# Altium schematic sheet Filtering.SchDoc: Myon Deco - Filtering Stages
size A; DrawnBy: Matias Lopez; Revision: Prototype; SheetNumber: 5; SheetTotal: 6
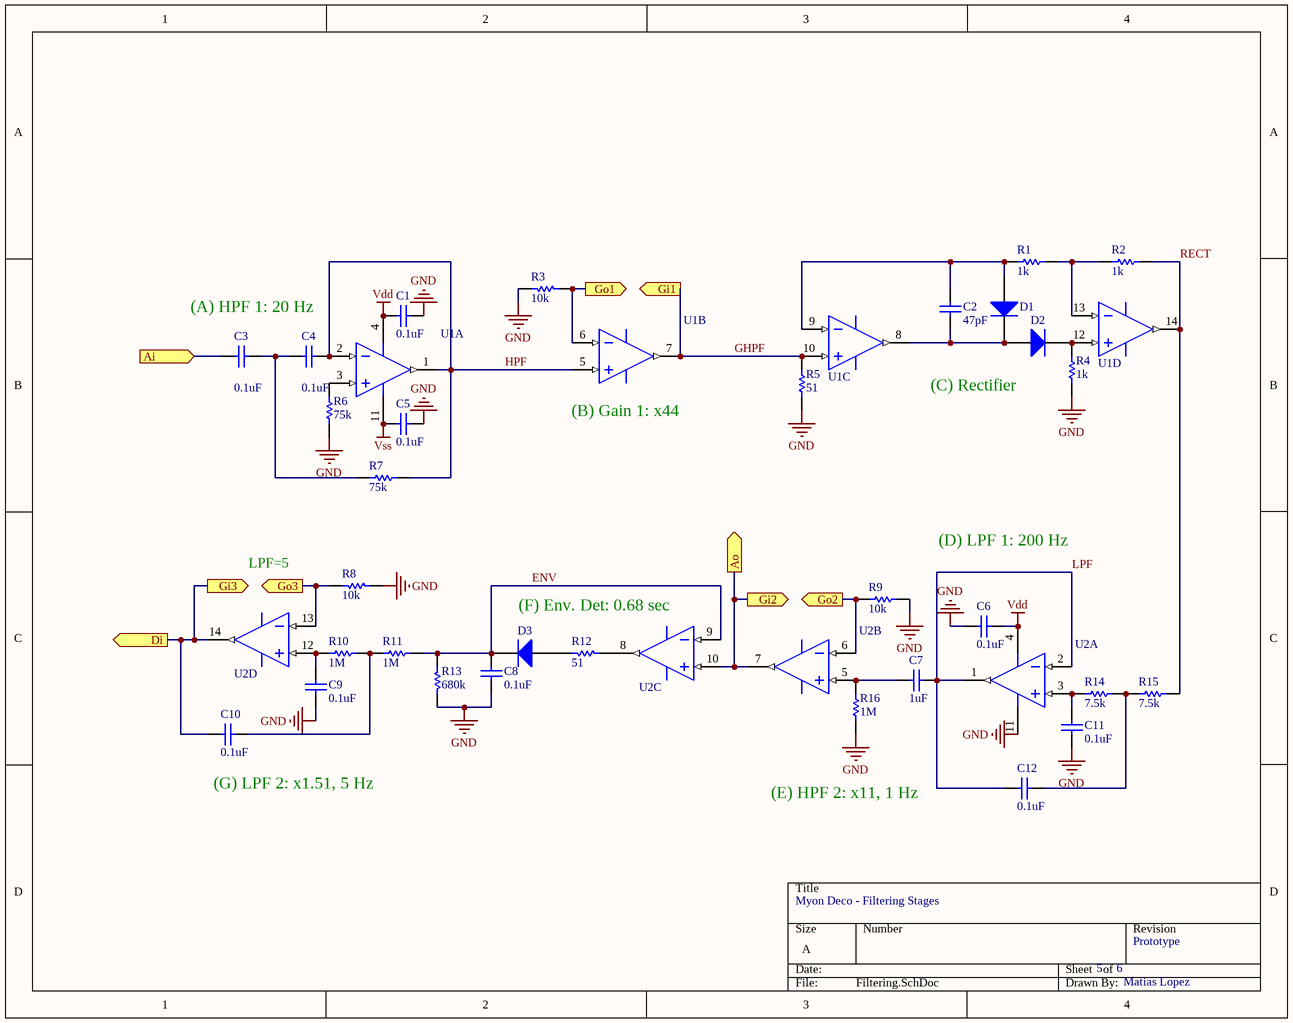
[diagram p0: Filtering.SchDoc]

## Parts
C1  value 0.1uF  [C0805]  (hidden comment: Cap)
C2  value 47pF  [C0805]  (hidden comment: C20)
C3  value 0.1uF  [C0805]  (hidden comment: C15)
C4  value 0.1uF  [C0805]  (hidden comment: C16)
C5  value 0.1uF  [C0805]  (hidden comment: Cap)
C6  value 0.1uF  [C0805]  (hidden comment: Cap)
C7  value 1uF  [C0805]  (hidden comment: C19)
C8  value 0.1uF  [C0805]  (hidden comment: C23)
C9  value 0.1uF  [C0805]  (hidden comment: C21)
C10  value 0.1uF  [C0805]  (hidden comment: C22)
C11  value 0.1uF  [C0805]  (hidden comment: C21)
C12  value 0.1uF  [C0805]  (hidden comment: C22)
D1  D2  [425]  (value not drawn)
D2  D3  [425]  (value not drawn)
D3  D4  [425]  (value not drawn)
R1  value 1k  [C1206]  (hidden comment: R20)
R2  value 1k  [C1206]  (hidden comment: R19)
R3  value 10k  [C1206]  (hidden comment: R13)
R4  value 1k  [C1206]  (hidden comment: R24)
R5  value 51  [C1206]  (hidden comment: R25)
R6  value 75k  [C1206]  (hidden comment: R15)
R7  value 75k  [C1206]  (hidden comment: R16)
R8  value 10k  [C1206]  (hidden comment: R26)
R9  value 10k  [C1206]  (hidden comment: R18)
R10  value 1M  [C1206]  (hidden comment: R21)
R11  value 1M  [C1206]  (hidden comment: R22)
R12  value 51  [C1206]  (hidden comment: R26)
R13  value 680k  [C1206]  (hidden comment: R27)
R14  value 7.5k  [C1206]  (hidden comment: R21)
R15  value 7.5k  [C1206]  (hidden comment: R22)
R16  value 1M  [C1206]  (hidden comment: R23)
U1  U7  [TI-D14_N]  (value not drawn)  (parts A,B,C,D of 4)
U2  U8  [TI-D14_N]  (value not drawn)  (parts A,B,C,D of 4)

## Ports
Ai (in), Ao (out), Di (out), Gi1 (out), Gi2 (out), Gi3 (out), Go1 (out), Go2 (out), Go3 (out)

## Nets
GND: C1.2 C5.2 C6.1 C8.1 C9.1 C11.1 R3.1 R4.1 R5.1 R6.1 R8.1 R9.1 R13.1 R16.2 U2.11(V-)
Vdd: C1.1 C6.2 U1.4(V+) U2.4(V+)
Vss: C5.1 U1.11(V-)
Ai: C3.1 ; port Ai
Ao: U2.7(OUT_B) U2.10(IN_C+) ; port Ao, port Gi2
Di: C10.1 U2.14(OUT_D) ; port Di, port Gi3
ENV: C8.2 D3.2(K) R11.1 R13.2 U2.9(IN_C-)
GHPF: R5.2 U1.7(OUT_B) U1.10(IN_C+) ; port Gi1
Go1: R3.2 U1.6(IN_B-) ; port Go1
Go2: R9.2 U2.6(IN_B-) ; port Go2
Go3: R8.2 U2.13(IN_D-) ; port Go3
HPF: C4.2 R7.1 U1.1(OUT_A) U1.2(IN_A-) U1.5(IN_B+)
LPF: C7.2 C12.1 U2.1(OUT_A) U2.2(IN_A-)
RECT: R2.1 R15.1 U1.14(OUT_D)
NetC2_1: C2.1 D1.1(A) R1.2 U1.9(IN_C-)
NetC2_2: C2.2 D1.2(K) D2.1(A) U1.8(OUT_C)
NetC3_2: C3.2 C4.1 R7.2
NetC7_1: C7.1 R16.1 U2.5(IN_B+)
NetC9_2: C9.2 R10.2 U2.12(IN_D+)
NetC10_2: C10.2 R10.1 R11.2
NetC11_2: C11.2 R14.2 U2.3(IN_A+)
NetC12_2: C12.2 R14.1 R15.2
NetD2_2: D2.2(K) R4.2 U1.12(IN_D+)
NetD3_1: D3.1(A) R12.1
NetR1_1: R1.1 R2.2 U1.13(IN_D-)
NetR6_2: R6.2 U1.3(IN_A+)
NetR12_2: R12.2 U2.8(OUT_C)

## Notes on the sheet
- (A) HPF 1: 20 Hz
- (near U1) (B) Gain 1: x44
- (C) Rectifier
- LPF=5
- (D) LPF 1: 200 Hz
- (F) Env. Det: 0.68 sec
- (near C10) (G) LPF 2: x1.51, 5 Hz
- (E) HPF 2: x11, 1 Hz

## Library data of the parts
C1-C12 = Cap: Capacitor; Published: 8-Jun-2000; LatestRevisionDate: 17-Jul-2002; LatestRevisionNote: Re-released for DXP Platform.; PackageReference: RAD-0.3; Publisher: Altium Limited; PackageDescription: Radial Cap, Thru-Hole; 2 Leads; 0.3 in Pin Spacing
D1-D3 = Diode 1N4148: High Conductance Fast Diode; Published: 8-Jun-2000; LatestRevisionDate: 17-Jul-2002; LatestRevisionNote: Re-released for DXP Platform.; DatasheetVersion: 1997; PackageReference: DO-35; Publisher: Altium Limited; PackageDescription: Diode, Axial; Body 3.8 x 1.9 mm (LxDia. max), Lead Dia. 0.53 mm (max); Code_JEDEC: DO-204-AH; ComponentLink1Description: Manufacturer Link; ComponentLink1URL: http://www.fairchildsemi.com/; ComponentLink2Description: Datasheet; ComponentLink2URL: http://www.fairchildsemi.com/ds/1N%2F1N4148.pdf
R1-R16 = Res1: Resistor; Published: 8-Jun-2000; LatestRevisionDate: 17-Jul-2002; LatestRevisionNote: Re-released for DXP Platform.; PackageReference: AXIAL-0.3; Publisher: Altium Limited; PackageDescription: Axial Device, Thru-Hole; 2 Leads; 0.3 in Pin Spacing
U1 U2 = OPA4180IDR: 0.1 uV/C Drift, Quad, Low Noise, Rail-to-Rail, Zero Drift Operational Amplifier, 4 to 36 V, -40 to 105 degC, 14-pin SOIC (D14), Green (RoHS & no Sb/Br); Manufacturer: Texas Instruments; CMRR(Min)(dB): 104; GBW(Typ)(MHz): 2; IIB(Max)(pA): 1700; Iq per channel(Max)(mA): 0.525; Number of Channels: 4; Offset Drift(Typ)(uV/C): 0.1; Rating: Catalog; Slew Rate(Typ)(V/us): 0.8; Sub Family: Precision Amplifier; Total Supply Voltage(Max)(+5V is 5, +/-5V is 10): 36; Vio (25C)(Max)(mV): 0.075; DatasheetVersion: SBOS584C; PackageVersion: 4040047-5/M, 06/2011; PackageReference: D14; PackageDescription: 14-Pin Plastic Small Outline, Body 8.65 x 3.9 mm, Pitch 1.27 mm; Eco-Plan: Green (RoHS & no Sb/Br); Total Supply Voltage(Min)(+5V is 5, +/-5V is 10): 4; Mounting Technology: Surface Mount; Code_JEDEC: MS-012; PartNumber: OPA4180IDR; ComponentLink1Description: Manufacturer URL; ComponentLink1URL: http://www.ti.com/; ComponentLink2Description: Datasheet; ComponentLink2URL: http://www.ti.com/lit/ds/symlink/opa4180.pdf; ComponentLink3Description: Package Specification; ComponentLink3URL: http://www.ti.com/lit/ml/mpds177g/mpds177g.pdf